# EAGLE design sensorboard (EAGLE 9.6.2)
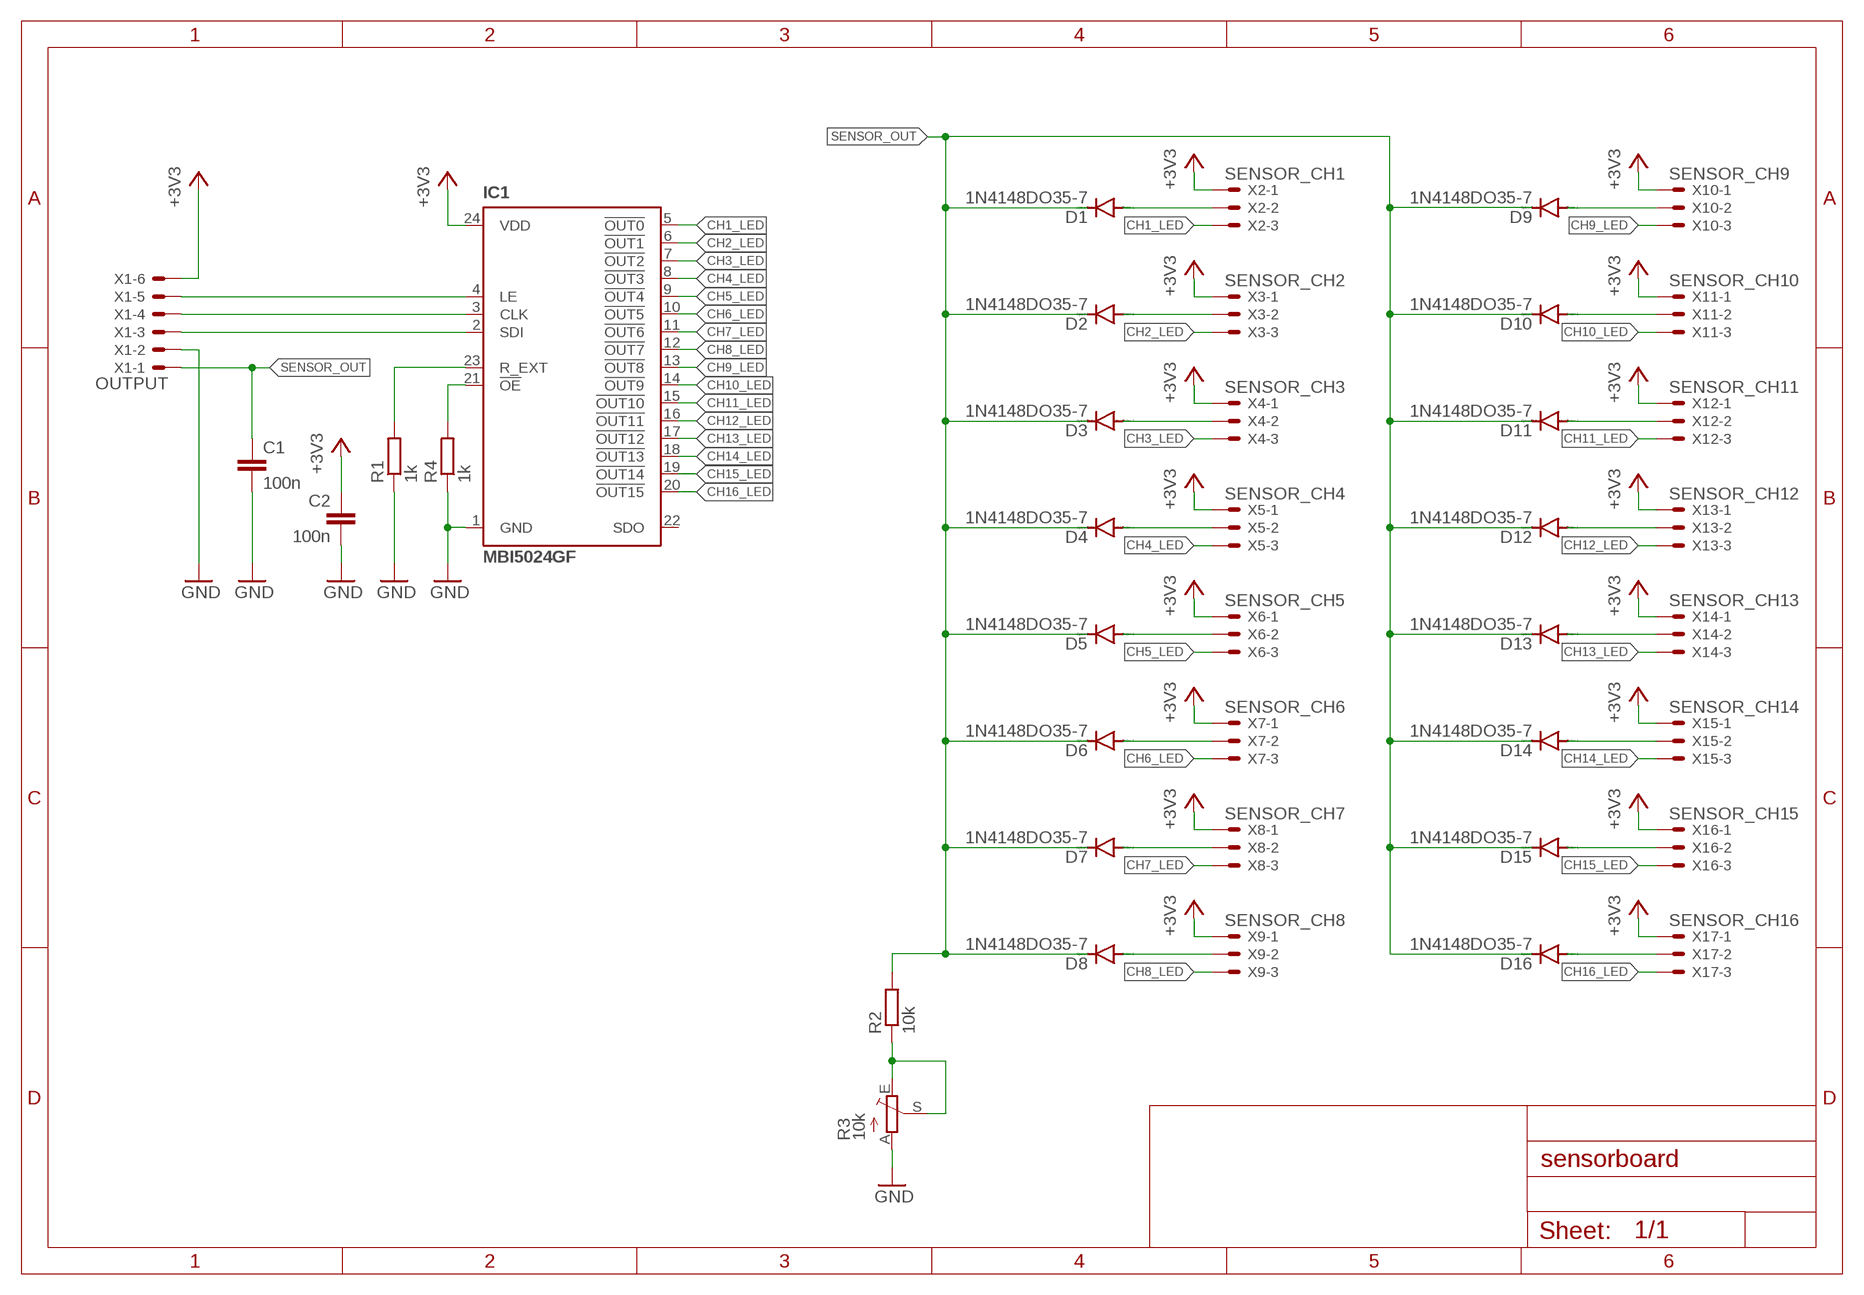
[diagram p0: schematic, sheet 1]

## Parts
C1  100n  C-EU050-024X044  [C050-024X044]
C2  100n  C-EU050-024X044  [C050-024X044]
D1  1N4148DO35-7  [DO35-7]
D2  1N4148DO35-7  [DO35-7]
D3  1N4148DO35-7  [DO35-7]
D4  1N4148DO35-7  [DO35-7]
D5  1N4148DO35-7  [DO35-7]
D6  1N4148DO35-7  [DO35-7]
D7  1N4148DO35-7  [DO35-7]
D8  1N4148DO35-7  [DO35-7]
D9  1N4148DO35-7  [DO35-7]
D10  1N4148DO35-7  [DO35-7]
D11  1N4148DO35-7  [DO35-7]
D12  1N4148DO35-7  [DO35-7]
D13  1N4148DO35-7  [DO35-7]
D14  1N4148DO35-7  [DO35-7]
D15  1N4148DO35-7  [DO35-7]
D16  1N4148DO35-7  [DO35-7]
IC1  MBI5024GF  [24PIN_SOP_ADAPTER]
R1  1k  R-EU_0207/10  [0207/10]
R2  10k  R-EU_0207/10  [0207/10]
R3  10k  TRIM_EU-CA6V  [CA6V]
R4  1k  R-EU_0207/10  [0207/10]
X1  OUTPUT  22-23-2061  [22-23-2061]
X2  SENSOR_CH1  22-23-2031  [22-23-2031]
X3  SENSOR_CH2  22-23-2031  [22-23-2031]
X4  SENSOR_CH3  22-23-2031  [22-23-2031]
X5  SENSOR_CH4  22-23-2031  [22-23-2031]
X6  SENSOR_CH5  22-23-2031  [22-23-2031]
X7  SENSOR_CH6  22-23-2031  [22-23-2031]
X8  SENSOR_CH7  22-23-2031  [22-23-2031]
X9  SENSOR_CH8  22-23-2031  [22-23-2031]
X10  SENSOR_CH9  22-23-2031  [22-23-2031]
X11  SENSOR_CH10  22-23-2031  [22-23-2031]
X12  SENSOR_CH11  22-23-2031  [22-23-2031]
X13  SENSOR_CH12  22-23-2031  [22-23-2031]
X14  SENSOR_CH13  22-23-2031  [22-23-2031]
X15  SENSOR_CH14  22-23-2031  [22-23-2031]
X16  SENSOR_CH15  22-23-2031  [22-23-2031]
X17  SENSOR_CH16  22-23-2031  [22-23-2031]

## Nets
+3V3: C2.1 IC1.24(VDD) X1.6 X2.1 X3.1 X4.1 X5.1 X6.1 X7.1 X8.1 X9.1 X10.1 X11.1 X12.1 X13.1 X14.1 X15.1 X16.1 X17.1
CH1_LED: IC1.5(!OUT0) X2.3
CH1_SENS: D1.A X2.2
CH2_LED: IC1.6(!OUT1) X3.3
CH2_SENS: D2.A X3.2
CH3_LED: IC1.7(!OUT2) X4.3
CH3_SENS: D3.A X4.2
CH4_LED: IC1.8(!OUT3) X5.3
CH4_SENS: D4.A X5.2
CH5_LED: IC1.9(!OUT4) X6.3
CH5_SENS: D5.A X6.2
CH6_LED: IC1.10(!OUT5) X7.3
CH6_SENS: D6.A X7.2
CH7_LED: IC1.11(!OUT6) X8.3
CH7_SENS: D7.A X8.2
CH8_LED: IC1.12(!OUT7) X9.3
CH8_SENS: D8.A X9.2
CH9_LED: IC1.13(!OUT8) X10.3
CH9_SENS: D9.A X10.2
CH10_LED: IC1.14(!OUT9) X11.3
CH10_SENS: D10.A X11.2
CH11_LED: IC1.15(!OUT10) X12.3
CH11_SENS: D11.A X12.2
CH12_LED: IC1.16(!OUT11) X13.3
CH12_SENS: D12.A X13.2
CH13_LED: IC1.17(!OUT12) X14.3
CH13_SENS: D13.A X14.2
CH14_LED: IC1.18(!OUT13) X15.3
CH14_SENS: D14.A X15.2
CH15_LED: IC1.19(!OUT14) X16.3
CH15_SENS: D15.A X16.2
CH16_LED: IC1.20(!OUT15) X17.3
CH16_SENS: D16.A X17.2
GND: C1.2 C2.2 IC1.1(GND) R1.1 R3.A R4.1 X1.2
N$1: IC1.4(LE) X1.5
N$2: IC1.23(R_EXT) R1.2
N$3: R2.1 R3.E R3.S
N$4: IC1.3(CLK) X1.4
N$5: IC1.2(SDI) X1.3
N$6: IC1.21(!OE) R4.2
SENSOR_OUT: C1.1 D1.C D2.C D3.C D4.C D5.C D6.C D7.C D8.C D9.C D10.C D11.C D12.C D13.C D14.C D15.C D16.C R2.2 X1.1
Unconnected: IC1.22(SDO)

## Library data of the parts
C1 C2 = rcl:C-EU: CAPACITOR, European symbol; SPICEPREFIX: C
D1-D16 = diode:1N4148: DIODE high speed (Philips)
IC1 = MBI_Chip:MBI5024GF
R1 R2 R4 = rcl:R-EU_: RESISTOR, European symbol; SPICEPREFIX: R
R3 = pot:TRIM_EU-: POTENTIOMETER
X1 = con-molex:22-23-2061: .100" (2.54mm) Center Header - 6 Pin; MF: MOLEX; MPN: 22-23-2061; OC_FARNELL: 1462922; OC_NEWARK: 27C1933
X2-X17 = con-molex:22-23-2031: .100" (2.54mm) Center Header - 3 Pin; MF: MOLEX; MPN: 22-23-2031; OC_FARNELL: 1462950; OC_NEWARK: 30C0862

## Board
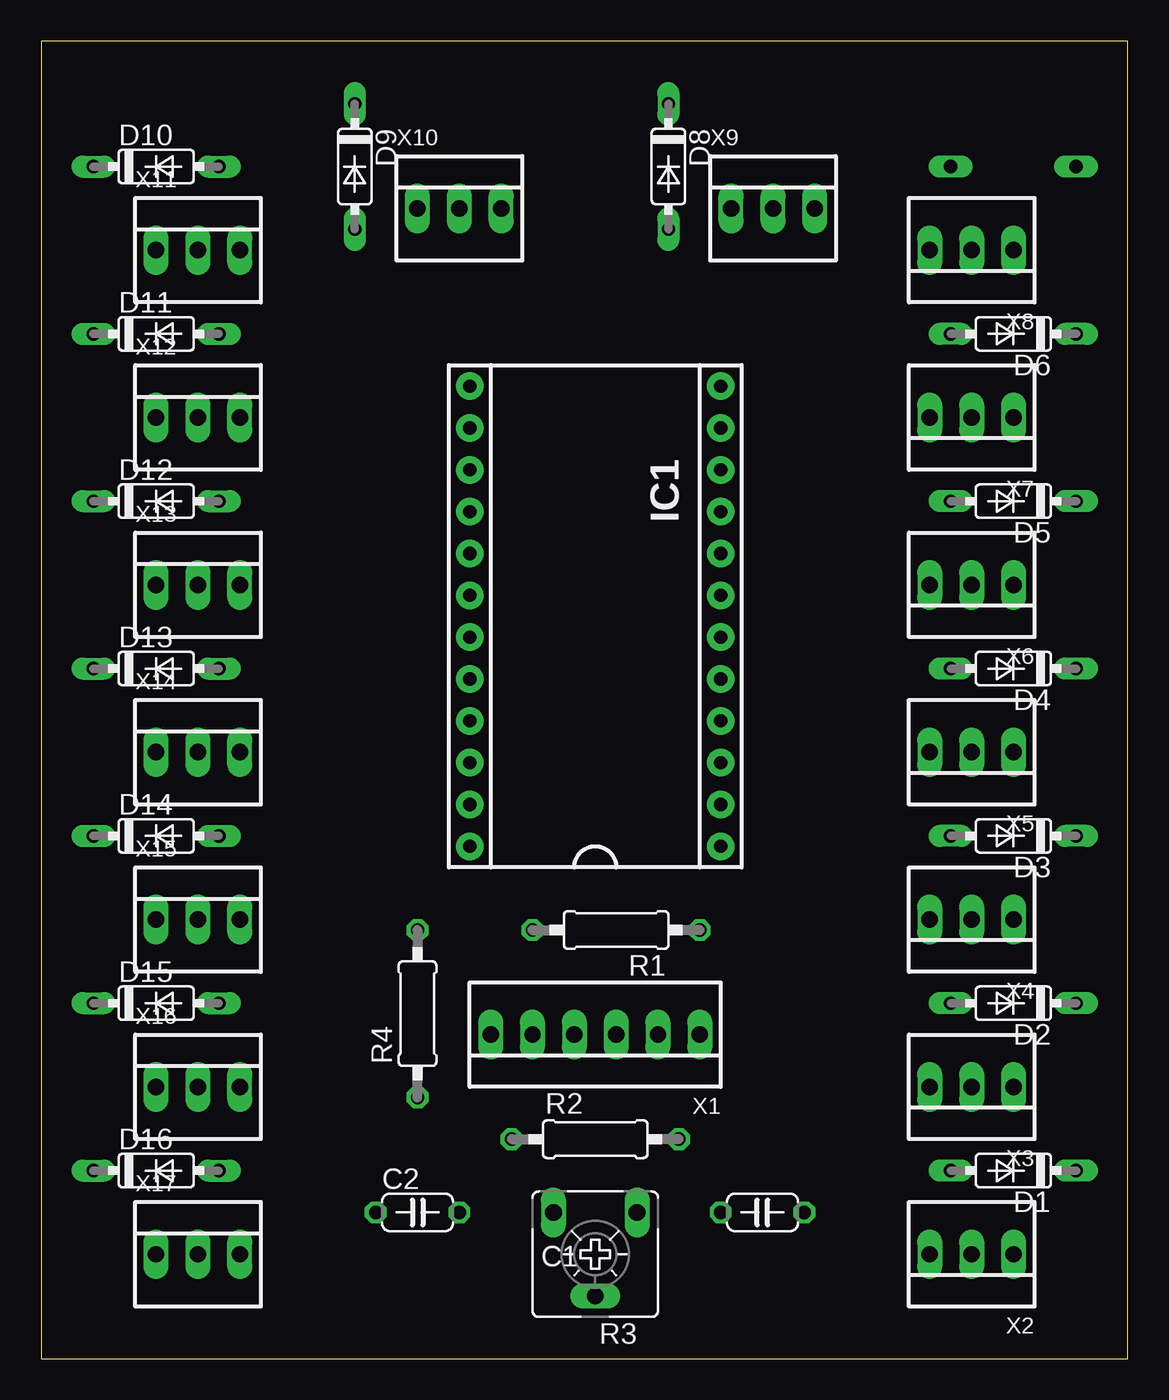
[diagram p1: board, top side]
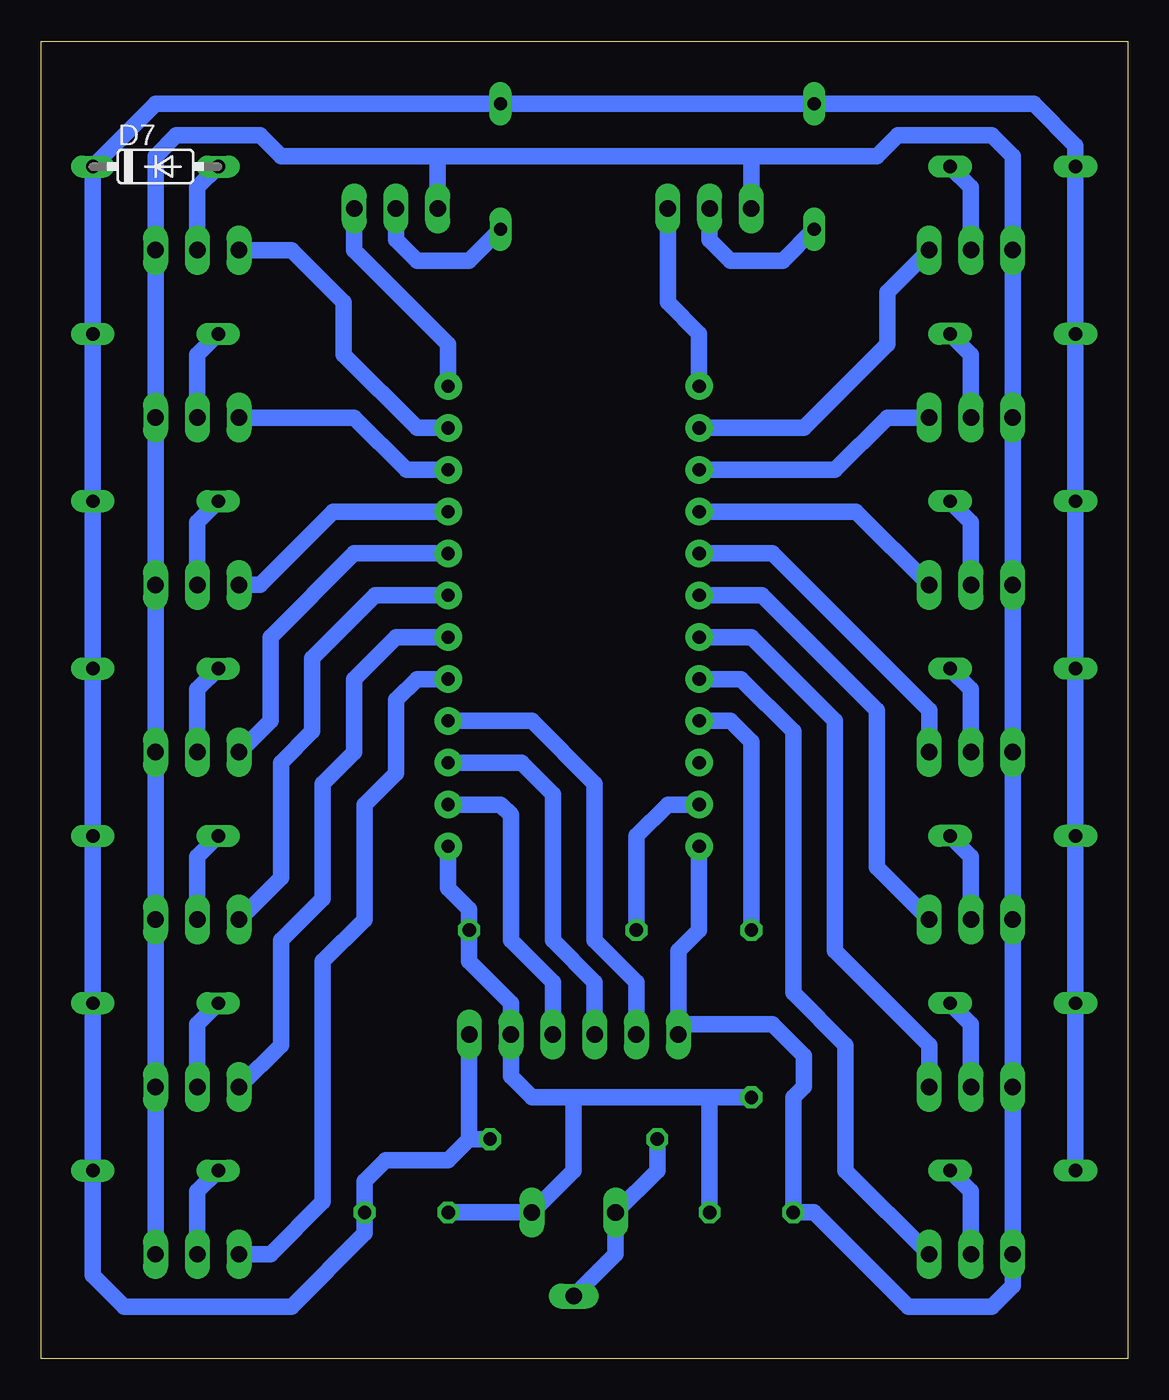
[diagram p2: board, bottom side, seen from below]

Size 66 x 80 mm. Coordinates in mm from the lower left corner, seen from the top.
Outline: 0,0 66,0 66,80 0,80 0,0
Copper layers (1*16): Top 0.035mm / dielectric 1.5mm / Bottom 0.035mm
Design rules "default": minimum track width 6mil, minimum drill 0.35mm, track to track 6mil, track to pad 6mil, pad to pad 6mil, via to via 6mil, smd to smd 6mil, copper to edge 40mil, drill to drill 6mil, minimum pad ring 10mil, minimum via ring 8mil, stop-mask expansion 4mil, vias tented up to drill 0mil, thermal gap 10mil

### Footprints (pad centres in the part's own frame; a part is rotated, then mirrored left to right if it is on the bottom)
C050-024X044 = drill 0.813 octagon: 1 -2.54,0; 2 2.54,0
DO35-7 = drill 0.813 long: A 3.81,0; C -3.81,0
24PIN_SOP_ADAPTER = drill 0.8 pad 1.676: 1 -7.62,13.97; 2 -7.62,11.43; 3 -7.62,8.89; 4 -7.62,6.35; 5 -7.62,3.81; 6 -7.62,1.27; 7 -7.62,-1.27; 8 -7.62,-3.81; 9 -7.62,-6.35; 10 -7.62,-8.89; 11 -7.62,-11.43; 12 -7.62,-13.97; 13 7.62,-13.97; 14 7.62,-11.43; 15 7.62,-8.89; 16 7.62,-6.35; 17 7.62,-3.81; 18 7.62,-1.27; 19 7.62,1.27; 20 7.62,3.81; 21 7.62,6.35; 22 7.62,8.89; 23 7.62,11.43; 24 7.62,13.97
0207/10 = drill 0.813 octagon: 1 -5.08,0; 2 5.08,0
CA6V = drill 1.016 long: A -2.54,-2.54; E 2.54,-2.54; S 0,2.54
22-23-2061 = drill 1 long: 1 -6.35,0; 2 -3.81,0; 3 -1.27,0; 4 1.27,0; 5 3.81,0; 6 6.35,0
22-23-2031 = drill 1 long: 1 -2.54,0; 2 0,0; 3 2.54,0

### Placement (x,y rotation side)
C1  43.81,8.89 180 top
C2  22.86,8.89 0 top
D1  59.05,11.43 180 top
D2  59.05,21.59 180 top
D3  59.05,31.75 180 top
D4  59.05,41.91 180 top
D5  59.05,52.07 180 top
D6  59.05,62.23 180 top
D7  59.05,72.39 0 bottom
D8  38.1,72.39 270 top
D9  19.05,72.39 270 top
D10  6.99,72.39 0 top
D11  6.99,62.23 0 top
D12  6.99,52.07 0 top
D13  6.99,41.91 0 top
D14  6.99,31.75 0 top
D15  6.99,21.59 0 top
D16  6.99,11.43 0 top
IC1  33.66,45.09 180 top
R1  34.92,26.04 180 top
R2  33.66,13.34 0 top
R3  33.66,6.35 180 top
R4  22.86,20.95 90 top
X1  33.66,19.68 180 top
X2  56.52,6.35 180 top
X3  56.52,16.51 180 top
X4  56.52,26.67 180 top
X5  56.52,36.83 180 top
X6  56.52,46.99 180 top
X7  56.52,57.15 180 top
X8  56.52,67.31 180 top
X9  44.45,69.85 0 top
X10  25.4,69.85 0 top
X11  9.53,67.31 0 top
X12  9.53,57.15 0 top
X13  9.53,46.99 0 top
X14  9.53,36.83 0 top
X15  9.53,26.67 0 top
X16  9.53,16.51 0 top
X17  9.53,6.35 0 top

### Tracks (layer width: path | path; a pad name or v marks a point on that pad's centre or on a via)
+3V3
  Bottom 1: X2.1 X3.1 X4.1 X5.1 X6.1 X7.1 X8.1 59.05,73.03 57.78,74.3 52.7,74.3 51.44,73.03 41.91,73.03 | IC1.24 26.04,26.04 27.3,24.77 27.3,20.32 | X1.6 27.3,20.32 | 41.91,73.03 22.86,73.03 | X9.1 41.91,73.03 | X10.1 22.86,73.03 | 22.86,73.03 15.24,73.03 13.97,74.3 8.26,74.3 6.99,73.03 X11.1 X12.1 X13.1 X14.1 X15.1 X16.1 X17.1 6.99,4.45 8.26,3.17 13.34,3.17 19.05,8.89 C2.1 20.32,15.88 19.68,16.51 19.68,18.41 21.59,20.32 27.3,20.32
CH1_LED
  Bottom 1: X2.3 52.07,6.35 48.9,9.53 48.9,24.13 46.35,26.67 46.35,33.66 44.45,35.56 44.45,40.01 43.18,41.27 IC1.5
CH1_SENS
  Bottom 1: X2.2 56.52,10.16 D1.A
CH2_LED
  Bottom 1: X3.3 51.44,19.05 51.44,25.4 48.9,27.94 48.9,34.92 46.99,36.83 46.99,41.27 44.45,43.81 IC1.6
CH2_SENS
  Bottom 1: X3.2 56.52,20.32 D2.A
CH3_LED
  Bottom 1: X4.3 51.44,29.21 51.44,36.2 49.53,38.1 49.53,42.55 45.72,46.35 IC1.7
CH3_SENS
  Bottom 1: X4.2 56.52,30.48 D3.A
CH4_LED
  Bottom 1: X5.3 52.07,38.73 52.07,43.81 46.99,48.9 IC1.8
CH4_SENS
  Bottom 1: X5.2 56.52,40.64 D4.A
CH5_LED
  Bottom 1: X6.3 52.7,46.99 48.26,51.44 IC1.9
CH5_SENS
  Bottom 1: X6.2 56.52,50.8 D5.A
CH6_LED
  Bottom 1: IC1.10 43.81,53.98 46.99,57.15 X7.3
CH6_SENS
  Bottom 1: X7.2 56.52,60.96 D6.A
CH7_LED
  Bottom 1: IC1.11 43.18,56.52 47.62,60.96 47.62,64.14 50.8,67.31 X8.3
CH7_SENS
  Bottom 1: D7.A 56.52,71.12 X8.2
CH8_LED
  Bottom 1: X9.3 46.99,67.31 41.27,61.59 IC1.12
CH8_SENS
  Bottom 1: D8.A 40.01,66.67 43.18,66.67 44.45,67.94 X9.2
CH9_LED
  Bottom 1: IC1.13 26.04,62.23 27.94,64.14 X10.3
CH9_SENS
  Bottom 1: D9.A 20.95,66.67 24.13,66.67 25.4,67.94 X10.2
CH10_LED
  Bottom 1: X11.3 14.61,64.77 14.61,61.59 19.68,56.52 IC1.14
CH10_SENS
  Bottom 1: X11.2 9.53,71.12 D10.A
CH11_LED
  Bottom 1: X12.3 14.61,57.15 17.78,53.98 IC1.15
CH11_SENS
  Bottom 1: X12.2 9.53,60.96 D11.A
CH12_LED
  Bottom 1: X13.3 16.51,51.44 IC1.16
CH12_SENS
  Bottom 1: D12.A 9.53,50.8 X13.2
CH13_LED
  Bottom 1: X14.3 12.06,39.37 21.59,48.9 IC1.17
CH13_SENS
  Bottom 1: X14.2 9.53,40.64 D13.A
CH14_LED
  Bottom 1: X15.3 15.24,29.84 15.24,39.37 22.23,46.35 IC1.18
CH14_SENS
  Bottom 1: X15.2 9.53,30.48 D14.A
CH15_LED
  Bottom 1: X16.3 12.06,19.05 17.78,24.77 17.78,38.73 22.86,43.81 IC1.19
CH15_SENS
  Bottom 1: X16.2 9.53,20.32 D15.A
CH16_LED
  Bottom 1: X17.3 17.14,11.43 17.14,19.05 20.32,22.23 20.32,38.1 23.5,41.27 IC1.20
CH16_SENS
  Bottom 1: D16.A 9.53,10.16 X17.2
GND
  Bottom 1: IC1.1 41.27,28.57 40.01,27.3 R1.1 40.01,24.13 37.47,21.59 X1.2 37.47,17.14 36.2,15.88 33.66,15.88 | 33.66,15.88 25.4,15.88 | 25.4,15.88 R4.1 | C2.2 25.4,15.88 | C1.2 R3.A 33.66,11.43 33.66,15.88
N$1
  Bottom 1: X1.5 29.84,22.86 32.38,25.4 32.38,34.92 36.2,38.73 IC1.4
N$2
  Bottom 1: IC1.23 27.94,33.66 29.84,31.75 R1.2
N$3
  Bottom 1: R3.S 31.11,6.35 R3.E 28.57,11.43 R2.1
N$4
  Bottom 1: X1.4 32.38,22.86 34.92,25.4 34.92,34.29 36.83,36.2 IC1.3
N$5
  Bottom 1: X1.3 34.92,22.86 37.47,25.4 37.47,33.02 38.1,33.66 IC1.2
N$6
  Bottom 1: IC1.21 24.13,38.73 22.86,37.47 R4.2
SENSOR_OUT
  Bottom 1: D16.C D15.C D14.C D13.C D12.C D11.C D10.C 3.17,73.66 5.71,76.2 D9.C D8.C 59.05,76.2 D7.C D6.C D5.C D4.C D3.C D2.C D1.C 62.87,5.08 60.96,3.17 50.8,3.17 46.35,7.62 C1.1 46.35,10.79 45.09,12.06 41.27,12.06 40.01,13.34 | X1.1 40.01,13.34 | R2.2 40.01,13.34